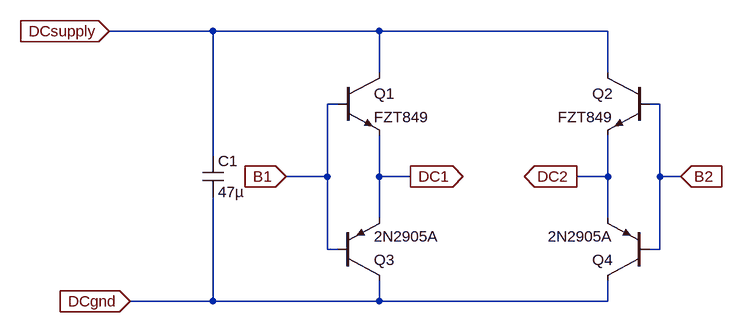
[diagram p0: schematic DC_Motor_Driver.asc]
DC_Motor_Driver.asc, the LTspice schematic file:
Version 4
SHEET 1 972 680
WIRE 160 0 0 0
WIRE 416 0 160 0
WIRE 768 0 416 0
WIRE 416 64 416 0
WIRE 768 64 768 0
WIRE 352 112 336 112
WIRE 848 112 832 112
WIRE 160 192 160 0
WIRE 336 224 336 112
WIRE 336 224 272 224
WIRE 416 224 416 160
WIRE 464 224 416 224
WIRE 768 224 768 160
WIRE 768 224 720 224
WIRE 848 224 848 112
WIRE 880 224 848 224
WIRE 416 288 416 224
WIRE 768 288 768 224
WIRE 336 336 336 224
WIRE 352 336 336 336
WIRE 848 336 848 224
WIRE 848 336 832 336
WIRE 160 416 160 256
WIRE 160 416 32 416
WIRE 416 416 416 384
WIRE 416 416 160 416
WIRE 768 416 768 384
WIRE 768 416 416 416
FLAG 0 0 DCsupply
IOPIN 0 0 In
FLAG 32 416 DCgnd
IOPIN 32 416 In
FLAG 272 224 B1
IOPIN 272 224 In
FLAG 464 224 DC1
IOPIN 464 224 Out
FLAG 720 224 DC2
IOPIN 720 224 Out
FLAG 880 224 B2
IOPIN 880 224 In
SYMBOL pnp 832 384 R180
SYMATTR InstName Q4
SYMATTR Value 2N2905A
SYMBOL pnp 352 384 M180
SYMATTR InstName Q3
SYMATTR Value 2N2905A
SYMBOL npn 352 64 R0
SYMATTR InstName Q1
SYMATTR Value FZT849
SYMBOL npn 832 64 M0
SYMATTR InstName Q2
SYMATTR Value FZT849
SYMBOL cap 144 192 R0
SYMATTR InstName C1
SYMATTR Value 47µ

The netlist it stands for:
* DC_Motor_Driver.asc
Q4 DCgnd B2 DC2 0 2N2905A
Q3 DCgnd B1 DC1 0 2N2905A
Q1 DCsupply B1 DC1 0 FZT849
Q2 DCsupply B2 DC2 0 FZT849
C1 DCsupply DCgnd 47µ
.model NPN NPN
.model PNP PNP
.lib standard.bjt
.backanno
.end